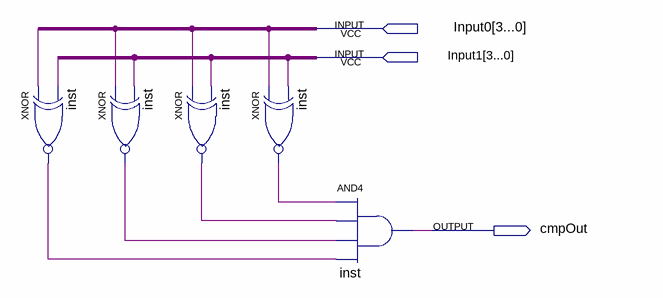
[diagram p0: schematic sheet]
// Quartus schematic EqCmp4.bdf as structural Verilog: 5 symbols, 3 pins
module EqCmp4 (
  input  \Input0[3...0] ,
  input  \Input1[3...0] ,
  output cmpOut
);

  wire inst_out, inst_out_2, inst_out_3, inst_out_4;

  xnor inst (inst_out_4, \Input0[3...0] , \Input1[3...0] );
  xnor inst_dup2 (inst_out_3, \Input0[3...0] , \Input1[3...0] );
  xnor inst_dup3 (inst_out_2, \Input0[3...0] , \Input1[3...0] );
  xnor inst_dup4 (inst_out, \Input0[3...0] , \Input1[3...0] );
  and inst_dup5 (cmpOut, inst_out, inst_out_2, inst_out_3, inst_out_4);
endmodule
